# Altium schematic sheet smart-plug.SchDoc: Title
size 297 x 209 mm; Date: *******; ApprovedBy: *******; CheckedBy: None; Author: *******; CompanyName: *******; DrawnBy: Name; Engineer: *******; Organization: *******; Address1: *******; Address2: *******; Address3: *******; Address4: *******; DocumentNumber: Doc Num; Revision: *******; SheetNumber: 1; SheetTotal: *******; CurrentTime: *******; CurrentDate: *******; Time: *******; DocumentFullPathAndName: *******; DocumentName: *******; ModifiedDate: *******; ImagePath: *******; ProjectName: *******; Application_BuildNumber: *******
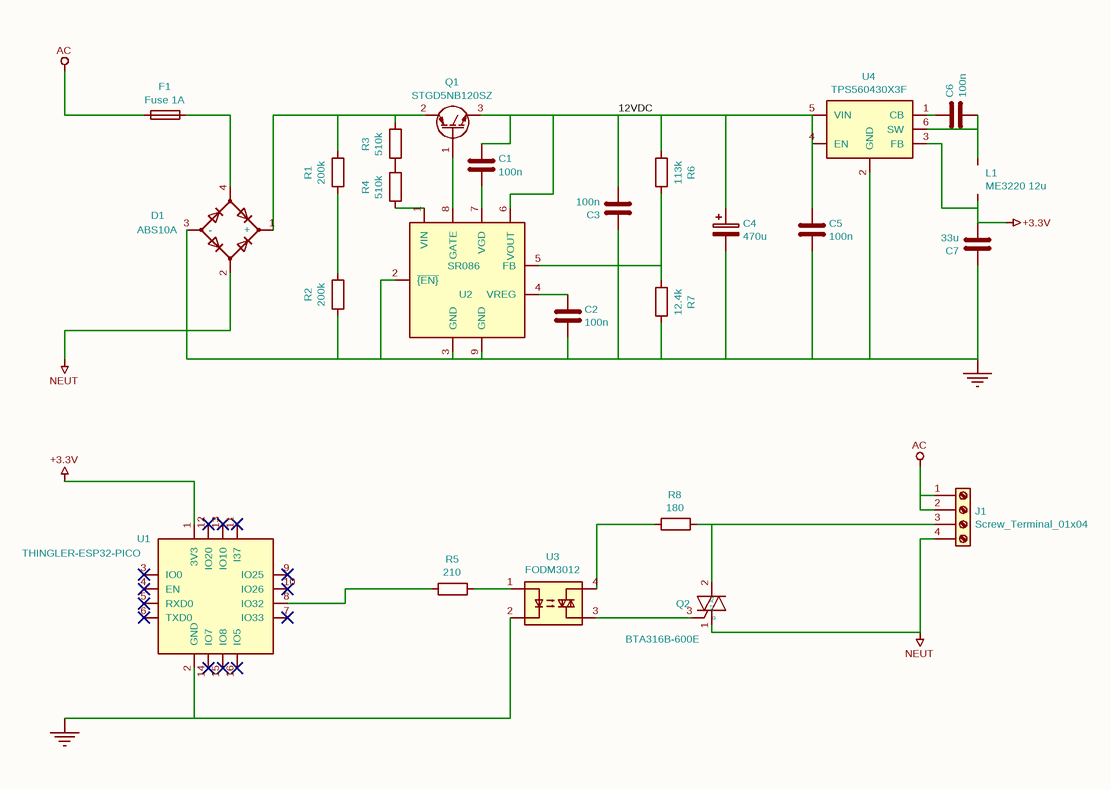
[diagram p0: smart-plug.SchDoc]

## Parts
C1  100n  [C_1206_3216Metric_Pad1.42x1.75mm_HandSolder]
C2  100n  [C_1206_3216Metric_Pad1.42x1.75mm_HandSolder]
C3  100n  [C_1206_3216Metric_Pad1.42x1.75mm_HandSolder]
C4  470u  [CP_EIA-7343-15_Kemet-W]
C5  100n  [C_1206_3216Metric_Pad1.42x1.75mm_HandSolder]
C6  100n  [C_1206_3216Metric_Pad1.42x1.75mm_HandSolder]
C7  33u  [C_1206_3216Metric_Pad1.42x1.75mm_HandSolder]
D1  ABS10A  [ABS10A]
F1  Fuse 1A  [fuse-2410]
J1  Screw_Terminal_01x04  [3d_power_connector]
L1  ME3220 12u  [ME3220]
Q1  STGD5NB120SZ  [TO-252-2]
Q2  BTA316B-600E  [to-263-2]
R1  200k  [R_1206_3216Metric_Pad1.42x1.75mm_HandSolder]
R2  200k  [R_1206_3216Metric_Pad1.42x1.75mm_HandSolder]
R3  510k  [R_1206_3216Metric_Pad1.42x1.75mm_HandSolder]
R4  510k  [R_1206_3216Metric_Pad1.42x1.75mm_HandSolder]
R5  210  [R_1206_3216Metric_Pad1.42x1.75mm_HandSolder]
R6  113k  [R_1206_3216Metric_Pad1.42x1.75mm_HandSolder]
R7  12.4k  [R_1206_3216Metric_Pad1.42x1.75mm_HandSolder]
R8  180  [R_1206_3216Metric_Pad1.42x1.75mm_HandSolder]
U1  THINGLER-ESP32-PICO  [Thingler-esp32-vertical]
U2  SR086  [SOIC-8-1EP_3.9x4.9mm_P1.27mm_EP2.29x3mm]
U3  FODM3012  [FODM3012]
U4  TPS560430X3F  [SOT-23-6]

## Nets
+3.3V: C7.2 L1.2 U1.1(3V3) U4.3(FB)
AC: F1.2 J1.1(Pin_1) J1.2(Pin_2)
Earth: C2.2 C3.1 C4.2 C5.2 C7.1 D1.3(-) R2.2 R7.1 U1.2(GND) U2.2(~{{EN}}) U2.3(GND) U2.9(GND) U3.2 U4.2(GND)
NEUT: D1.2 J1.4(Pin_4) Q2.1(A1)
12VDC: C1.1 C3.2 C4.1 C5.1 Q1.3(E) R6.2 U2.6(VOUT) U4.4(EN) U4.5(VIN)
NetC1_2: C1.2 U2.7(VGD)
NetC2_1: C2.1 U2.4(VREG)
NetC6_1: C6.1 U4.1(CB)
NetC6_2: C6.2 L1.1 U4.6(SW)
NetD1_1: D1.1(+) Q1.2(C) R1.1 R3.1
NetD1_4: D1.4 F1.1
NetJ1_3: J1.3(Pin_3) Q2.2(A2) R8.1
NetQ1_1: Q1.1(G) U2.8(GATE)
NetQ2_3: Q2.3(G) U3.3
NetR1_2: R1.2 R2.1
NetR3_2: R3.2 R4.1
NetR4_2: R4.2 U2.1(VIN)
NetR5_1: R5.1 U3.1
NetR5_2: R5.2 U1.8(IO32)
NetR6_1: R6.1 R7.2 U2.5(FB)
NetR8_2: R8.2 U3.4

Not connected (* = marked no-connect by the designer): U1 3(IO0)* 4(EN)* 5(RXD0)* 6(TXD0)* 7(IO33)* 9(IO25)* 10(IO26)* 11(I37)* 12(IO20)* 13(IO10)* 14(IO7)* 15(IO8)* 16(IO5)*

## Notes on the sheet
- 1
- 2
- 3
- 4
- 5
- 6
- A
- B
- C
- Title:
- D
- File: smart-plug.kicad_sch
- Sheet: /
- Drawn By:
- Page Contents:
- Checked By:
- KiCad E.D.A.  kicad (5.1.4)-1
- Size: A4
- Date:
- Rev:
- Id: 1/1
- Size:
- File:
- License:
- Email:
- A3
- UA P\N:
- Time:
- Issue:
- Sheet
- Revision:
- Website:
- Variant:
- of

## Library data of the parts
C1-C3 C5-C7 = C: Footprint: Capacitor_SMD:C_1206_3216Metric_Pad1.42x1.75mm_HandSolder
  C1-C3 C5 C6: Value: 100n
  C7: Value: 33u
C4 = C_Polarized: Value: 470u; Footprint: Capacitor_Tantalum_SMD:CP_EIA-7343-15_Kemet-W
D1 = D_Bridge_+A-A: Value: ABS10A; Footprint: smart-plug:ABS10A
F1 = Fuse: Value: Fuse 1A; Footprint: smart-plug:fuse-2410
L1 = L: Value: ME3220 12u; Footprint: smart-plug:ME3220
Q1 = Q_NIGBT_GCE: Value: STGD5NB120SZ; Footprint: Package_TO_SOT_SMD:TO-252-2
Q2 = BT138-600: Value: BTA316B-600E; Footprint: smart-plug:to-263-2
R1-R8 = R: Footprint: Resistor_SMD:R_1206_3216Metric_Pad1.42x1.75mm_HandSolder
  R1 R2: Value: 200k
  R3 R4: Value: 510k
  R5: Value: 210
  R6: Value: 113k
  R7: Value: 12.4k
  R8: Value: 180
U4 = TPS560430: Value: TPS560430X3F; Footprint: Package_TO_SOT_SMD:SOT-23-6
J1 = Screw_Terminal_01x04: Value: Screw_Terminal_01x04; Footprint: smart-plug:3d_power_connector
U1 = THINGLER-ESP32-PICO: Value: THINGLER-ESP32-PICO; Footprint: smart-plug:Thingler-esp32-vertical
U2 = SR086: Value: SR086; Footprint: Package_SO:SOIC-8-1EP_3.9x4.9mm_P1.27mm_EP2.29x3mm
U3 = FODM3012: Value: FODM3012; Footprint: smart-plug:FODM3012